# Altium schematic sheet DC_DC.SchDoc
size A3
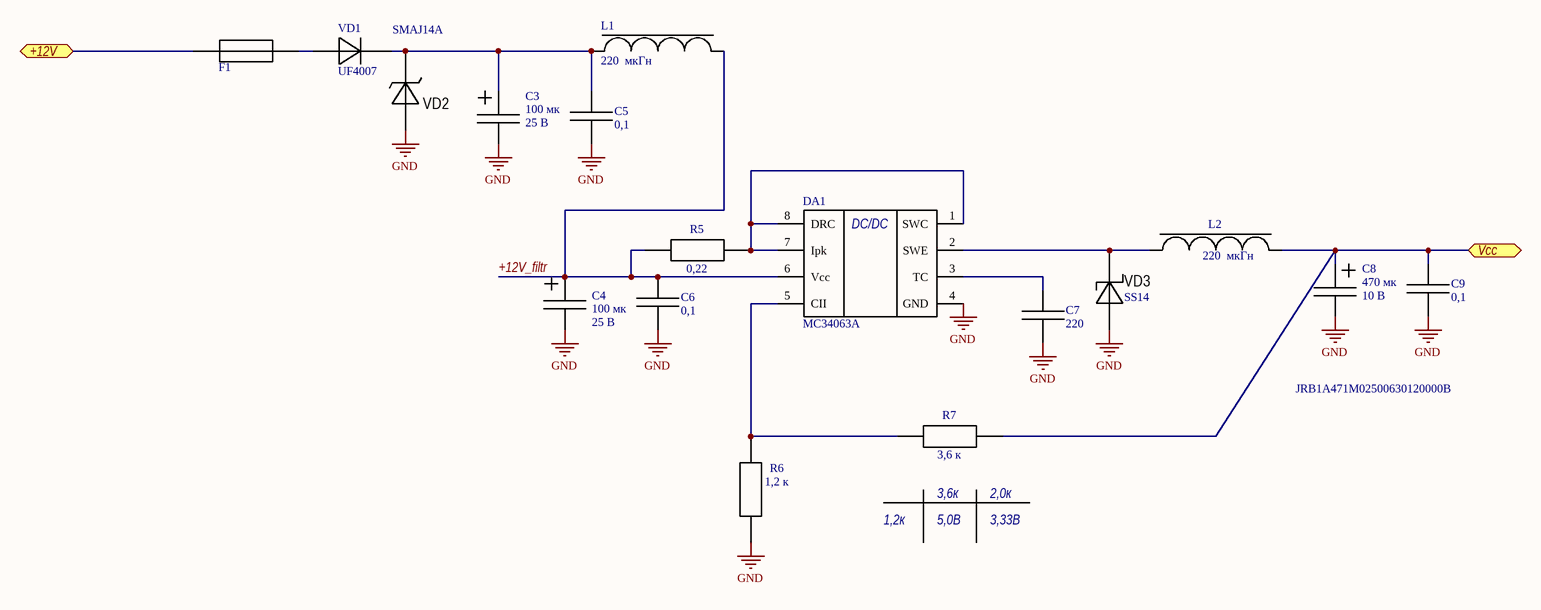
[diagram p0: DC_DC.SchDoc]

## Parts
C3  Power/Voltage: 25 В  Value Sch: 100 мк  [K50-35_6.3mm]
C4  Power/Voltage: 25 В  Value Sch: 100 мк  [K50-35_6.3mm]
C5  Value Sch: 0,1  [C0603_autoMount]  (hidden comment: Конденсаторы керамические)
C6  Value Sch: 0,1  [C0603_autoMount]  (hidden comment: Конденсаторы керамические)
C7  Value Sch: 220  [C0603_autoMount]  (hidden comment: Конденсаторы керамические)
C8  Power/Voltage: 10 В  Value Sch: 470 мк  [K50-35_8mm]  (hidden comment: Конденсаторы электролитические)
C9  Value Sch: 0,1  [C0603_autoMount]  (hidden comment: Конденсаторы керамические)
DA1  MC34063A  [SO-8]
F1  Fuse  [R1812]  (value not drawn)
L1  220  мкГн  [SDR0604]
L2  220  мкГн  [SDR0604]
R5  Value Sch: 0,22  [R1206_autoMount]  (hidden comment: Resistor)
R6  Value Sсh: 1,2 к  [R0603_autoMount]  (hidden comment: Resistor)
R7  Value Sсh: 3,6 к  [R0603_autoMount]  (hidden comment: Resistor)
VD1  ManufacturerPartNumber: UF4007  [DO-41_H_10mm]  (hidden comment: Diode)
VD2  TVS  [DO-214AC SMA]  (value not drawn)
VD3  ManufacturerPartNumber: SS14  [DO-214AC_SMA]  (hidden comment: Shottke)

## Ports
+12V, Vcc

## Nets
GND: C3.2 C4.2 C5.1 C6.1 C7.1 C8.2 C9.1 DA1.4(GND) R6.2 VD2.2 VD3.2
+12V: F1.2 ; port +12V
+12V_filtr: C4.1 C6.2 DA1.6(Vcc) L1.1 R5.2
Vcc: C8.1 C9.2 L2.1 R7.2 ; port Vcc
NetC3_1: C3.1 C5.2 L1.2 VD1.1 VD2.1
NetC7_2: C7.2 DA1.3(TC)
NetDA1_1: DA1.1(SWC) DA1.7(Ipk) DA1.8(DRC) R5.1
NetDA1_2: DA1.2(SWE) L2.2 VD3.1
NetDA1_5: DA1.5(CII) R6.1 R7.1
NetF1_1: F1.1 VD1.2

## Notes on the sheet
- SMAJ14A
- JRB1A471M02500630120000B
- (near R7) 3,6к
- (near R7) 2,0к
- 1,2к
- 5,0В
- 3,33В
- (in symbol Микросхема MC34063EC "ST Microelectronix" SO-8) DC/DC

## Library data of the parts
C3 C4 = Конденсатор электролит. K50-35 100 мкФ 25 В +/- 20% JRB1E101M02500630110000B "JB": Part Number Euro: K50-35 100 uF 25 V +/- 20% JRB1E101M02500630110000B "JB"; Manufacturer: "JB"; Voltage Euro: 25 V; Tolerance: +/- 20%; Value: 100 мкФ; Value Euro: 100 uF; Part Number: Конденсатор электролит. K50-35 100 мкФ 25 В +/- 20% JRB1E101M02500630110000B "JB"; ManufacturerPartNumber: JRB1E101M02500630110000B; Package: K50-35; ComponentType: Конденсатор электролит.
C5 C6 C9 = Чип. керам. 0603 0,1 мкФ 50 В +/-10% X7R CC0603KKX7R9BB104 "Yageo": Part Number Euro: 100 nF 50  V +/-10% X7R CC0603KKX7R9BB104 "Yageo"; Power/Voltage: 50 В; Voltage Euro: 50  V; TKE: X7R; Tolerance: +/-10%; Value: 0,1 мкФ; Value Euro: 100 nF; Part Number: Чип. керам. 0603 0,1 мкФ 50 В +/-10% X7R CC0603KKX7R9BB104 "Yageo"; Manufacturer: "Yageo"; ManufacturerPartNumber: CC0603KKX7R9BB104; Package: Чип конд. 0603; Price: 9; ComponentType: Чип. керам. 0603
C7 = Чип. керам. 0603 220 пФ 50 В +/-5% NP0 GRM1885C1H221J "Murata": Part Number Euro: 220 50 V +/-5% NP0 GRM1885C1H221J "Murata"; Power/Voltage: 50 В; Voltage Euro: 50 V; TKE: NP0; Tolerance: +/-5%; Value: 220 пФ; Part Number: Чип. керам. 0603 220 пФ 50 В +/-5% NP0 GRM1885C1H221J "Murata"; Manufacturer: "Murata"; ManufacturerPartNumber: GRM1885C1H221J; Package: Чип конд. 0603; Value Euro: 220; ComponentType: Чип. керам. 0603
C8 = Конденсатор электролит. К50-35 470 мкФ 10 В +/- 20% JRK1A471M03500800070000B: Part Number Euro: К50-35 470 uF 10 V +/- 20% JRK1A471M03500800070000B; Voltage Euro: 10 V; Tolerance: +/- 20%; Value: 470 мкФ; Value Euro: 470 uF; Part Number: Конденсатор электролит. К50-35 470 мкФ 10 В +/- 20% JRK1A471M03500800070000B; ManufacturerPartNumber: JRK1A471M03500800070000B; Package: К50-35; ComponentType: Конденсатор электролит.
DA1 = Микросхема MC34063EC "ST Microelectronix" SO-8: Manufacturer: "ST Microelectronix"; ManufacturerPartNumber: MC34063EC; Package: SO-8; Part Number: Микросхема MC34063EC "ST Microelectronix" SO-8; Part Number Euro: MC34063EC "ST Microelectronix" SO-8; ComponentType: Микросхема
F1 = Предохранитель   0,2 A, 30 В 1812L020PR "Littelfuse": Part Number: Предохранитель   0,2 A, 30 В 1812L020PR "Littelfuse"; Part Number Euro: 0,2 A, 30 В 1812L020PR "Littelfuse"; Manufacturer: "Littelfuse"; ManufacturerPartNumber: 1812L020PR; Power/Voltage: 0,2 A, 30 В; ComponentType: Предохранитель
L1 L2 = Дроссель 220  мкГн +/-20% SDR0604-221KL "Bourns": Part Number Euro: 220  uH +/-20% SDR0604-221KL "Bourns"; Tolerance: +/-20%; Value Euro: 220  uH; Manufacturer: "Bourns"; ManufacturerPartNumber: SDR0604-221KL; Value: 220  мкГн; Part Number: Дроссель 220  мкГн +/-20% SDR0604-221KL "Bourns"; Value Sch: 220  мкГн; ComponentType: Дроссель
R5 = Чип рез. 1206 0,22 Ом  +/-1% RC1206FR-070R22L "Yageo": Part Number Euro: RC1206FR-070R22L 0,22 Ом +/-1% "Yageo"; Tolerance: +/-1%; Value: 0,22 Ом; Part Number: Чип рез. 1206 0,22 Ом  +/-1% RC1206FR-070R22L "Yageo"; Manufacturer: "Yageo"; ManufacturerPartNumber: RC1206FR-070R22L; Package: Чип рез. 1206; Value Euro: 0,22 Ом; ComponentType: Чип рез. 1206
R6 = Чип рез. 0603 1,2 кОм  +/-1% RC0603FR-071K2L "Yageo": Part Number Euro: RC0603FR-071K2L 1,2 K +/-1% "Yageo"; Tolerance: +/-1%; Value: 1,2 кОм; Value Euro: 1,2 K; Part Number: Чип рез. 0603 1,2 кОм  +/-1% RC0603FR-071K2L "Yageo"; Manufacturer: "Yageo"; ManufacturerPartNumber: RC0603FR-071K2L; Package: Чип рез. 0603; ComponentType: Чип рез. 0603
R7 = Чип рез. 0603 3,6 кОм  +/-1% RC0603FR-073K6L "Yageo": Part Number Euro: RC0603FR-073K6L 3,6 K +/-1% "Yageo"; Tolerance: +/-1%; Value: 3,6 кОм; Value Euro: 3,6 K; Part Number: Чип рез. 0603 3,6 кОм  +/-1% RC0603FR-073K6L "Yageo"; Manufacturer: "Yageo"; ManufacturerPartNumber: RC0603FR-073K6L; Package: Чип рез. 0603; ComponentType: Чип рез. 0603
VD1 = Диод UF4007 "ST Microelectronics" DO-41: Part Number: Диод UF4007 "ST Microelectronics" DO-41; Part Number Euro: UF4007 "ST Microelectronics" DO-41; Manufacturer: "ST Microelectronics"; Package: DO-41; ComponentType: Диод
VD2 = Диод SMAJ14A "Littelfuse" SMA/DO-214AC: Part Number: Диод SMAJ14A "Littelfuse" SMA/DO-214AC; Part Number Euro: SMAJ14A "Littelfuse" SMA/DO-214AC; Manufacturer: "Littelfuse"; ManufacturerPartNumber: SMAJ14A; Package: SMA/DO-214AC; ComponentType: Диод
VD3 = Диод SS14 "ON Semiconductor" SMA/DO-214AC: Part Number: Диод SS14 "ON Semiconductor" SMA/DO-214AC; Part Number Euro: SS14 "ON Semiconductor" SMA/DO-214AC; Manufacturer: "ON Semiconductor"; Package: SMA/DO-214AC; ComponentType: Диод